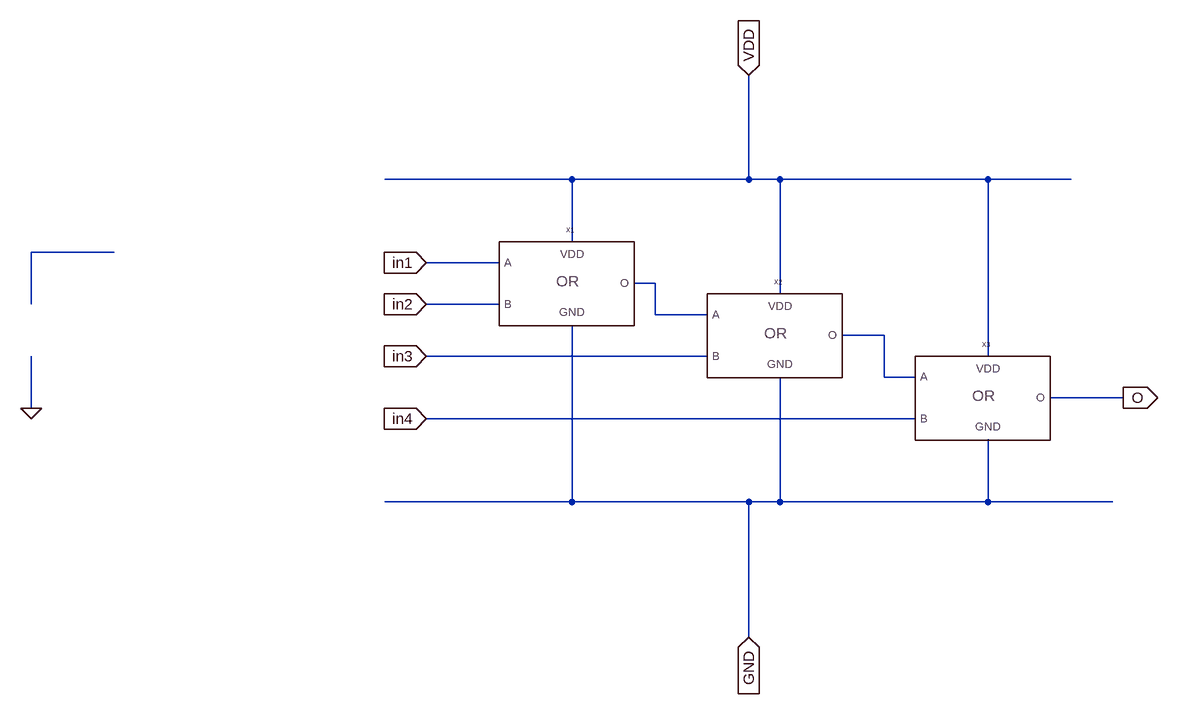
[diagram p0: schematic or_4_ip.asc]
or_4_ip.asc, the LTspice schematic file:
Version 4
SHEET 1 1084 800
WIRE 160 -16 -128 -16
WIRE 432 -16 432 -176
WIRE 432 -16 160 -16
WIRE 480 -16 432 -16
WIRE 800 -16 480 -16
WIRE 928 -16 800 -16
WIRE 160 80 160 -16
WIRE -544 96 -672 96
WIRE 48 112 -64 112
WIRE 288 144 256 144
WIRE 480 160 480 -16
WIRE -672 176 -672 96
WIRE 48 176 -64 176
WIRE 288 192 288 144
WIRE 368 192 288 192
WIRE 640 224 576 224
WIRE 368 256 -64 256
WIRE 800 256 800 -16
WIRE 640 288 640 224
WIRE 688 288 640 288
WIRE 1008 320 896 320
WIRE -672 336 -672 256
WIRE 688 352 -64 352
WIRE 160 480 160 208
WIRE 160 480 -128 480
WIRE 432 480 160 480
WIRE 480 480 480 288
WIRE 480 480 432 480
WIRE 800 480 800 384
WIRE 800 480 480 480
WIRE 992 480 800 480
WIRE 432 688 432 480
FLAG -64 112 in1
IOPIN -64 112 In
FLAG -64 176 in2
IOPIN -64 176 In
FLAG -64 256 in3
IOPIN -64 256 In
FLAG -64 352 in4
IOPIN -64 352 In
FLAG 1008 320 O
IOPIN 1008 320 Out
FLAG -672 336 0
FLAG 432 -176 VDD
IOPIN 432 -176 In
FLAG 432 688 GND
IOPIN 432 688 In
SYMBOL or 144 144 R0
SYMATTR InstName X1
SYMBOL or 464 224 R0
SYMATTR InstName X2
SYMBOL or 784 320 R0
SYMATTR InstName X3

The netlist it stands for:
* or_4_ip.asc
XX1 in1 in2 VDD GND N002 or  ; pins A B VDD GND O
XX2 N002 in3 VDD GND N003 or  ; pins A B VDD GND O
XX3 N003 in4 VDD GND O or  ; pins A B VDD GND O
.backanno
.end